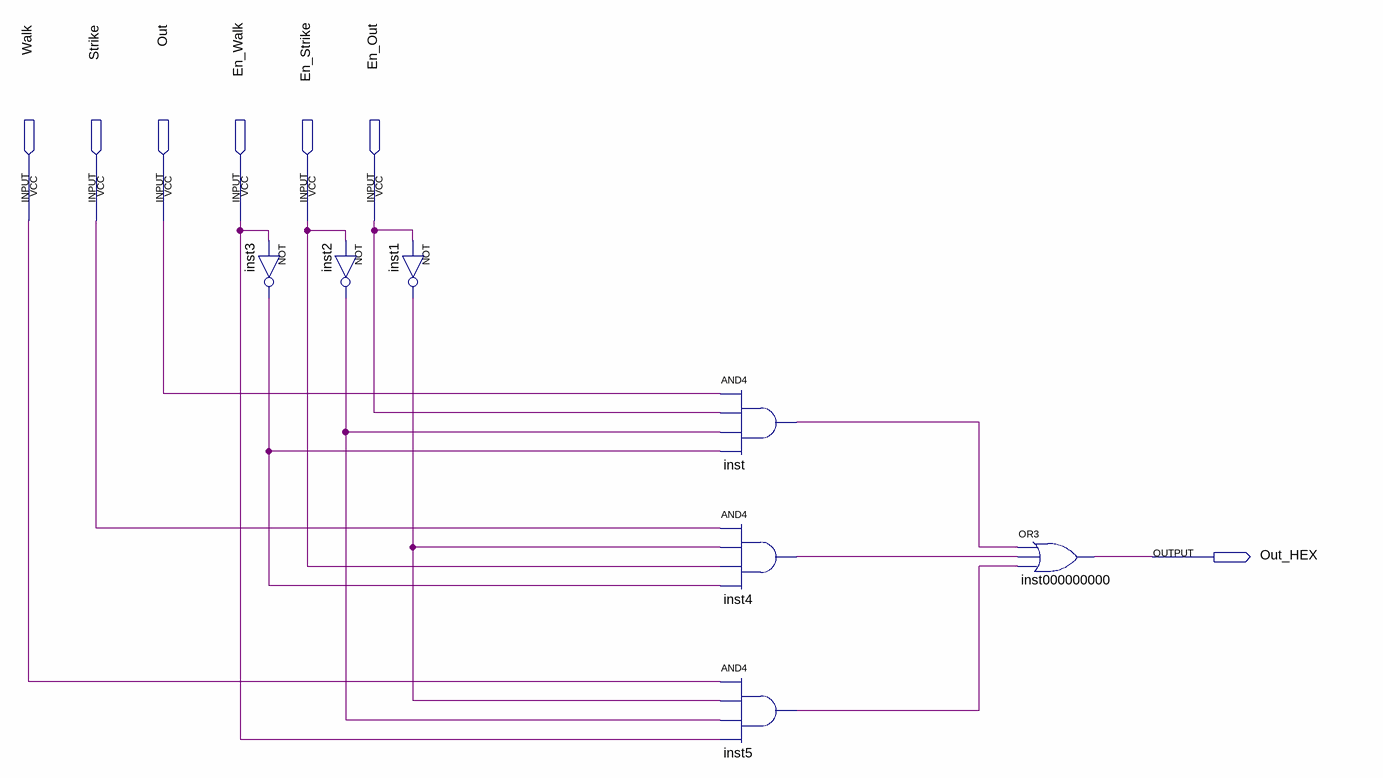
[diagram p0: schematic sheet]
// Quartus schematic SeletorHEX.bdf as structural Verilog: 7 symbols, 7 pins
module SeletorHEX (
  input  Walk,
  input  Strike,
  input  Out,
  input  En_Walk,
  input  En_Strike,
  input  En_Out,
  output Out_HEX
);

  wire inst1_out, inst2_out, inst3_out, inst4_out, inst5_out, inst_out;

  not inst3 (inst3_out, En_Walk);
  not inst2 (inst2_out, En_Strike);
  not inst1 (inst1_out, En_Out);
  and inst (inst_out, Out, En_Out, inst2_out, inst3_out);
  and inst4 (inst4_out, Strike, inst1_out, En_Strike, inst3_out);
  and inst5 (inst5_out, Walk, inst1_out, inst2_out, En_Walk);
  or inst000000000 (Out_HEX, inst_out, inst4_out, inst5_out);
endmodule
